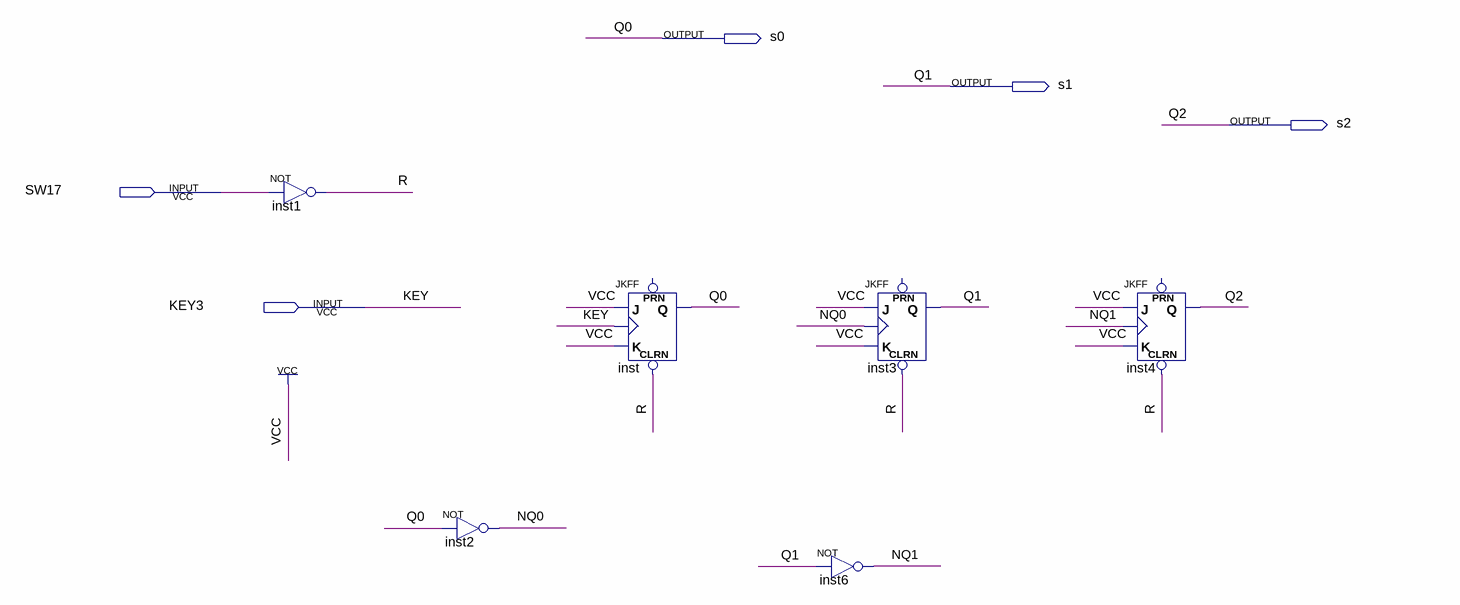
[diagram p0: schematic sheet]
// Quartus schematic ContadorA.bdf as structural Verilog: 6 symbols, 5 pins
module ContadorA (
  input  SW17,
  input  KEY3,
  output s0,
  output s1,
  output s2
);

  wire NQ0, NQ1, R;

  not inst1 (R, SW17);
  not inst2 (NQ0, s0);
  JKFF inst (.CLRN(R), .K(1'b1), .J(1'b1), .CLK(KEY3), .Q(s0));  // open: PRN
  JKFF inst3 (.CLRN(R), .K(1'b1), .J(1'b1), .CLK(NQ0), .Q(s1));  // open: PRN
  not inst6 (NQ1, s1);
  JKFF inst4 (.CLRN(R), .K(1'b1), .J(1'b1), .CLK(NQ1), .Q(s2));  // open: PRN

  // Other names for the same wires on the sheet: KEY = KEY3; Q0 = s0; Q1 = s1; Q2 = s2
endmodule
